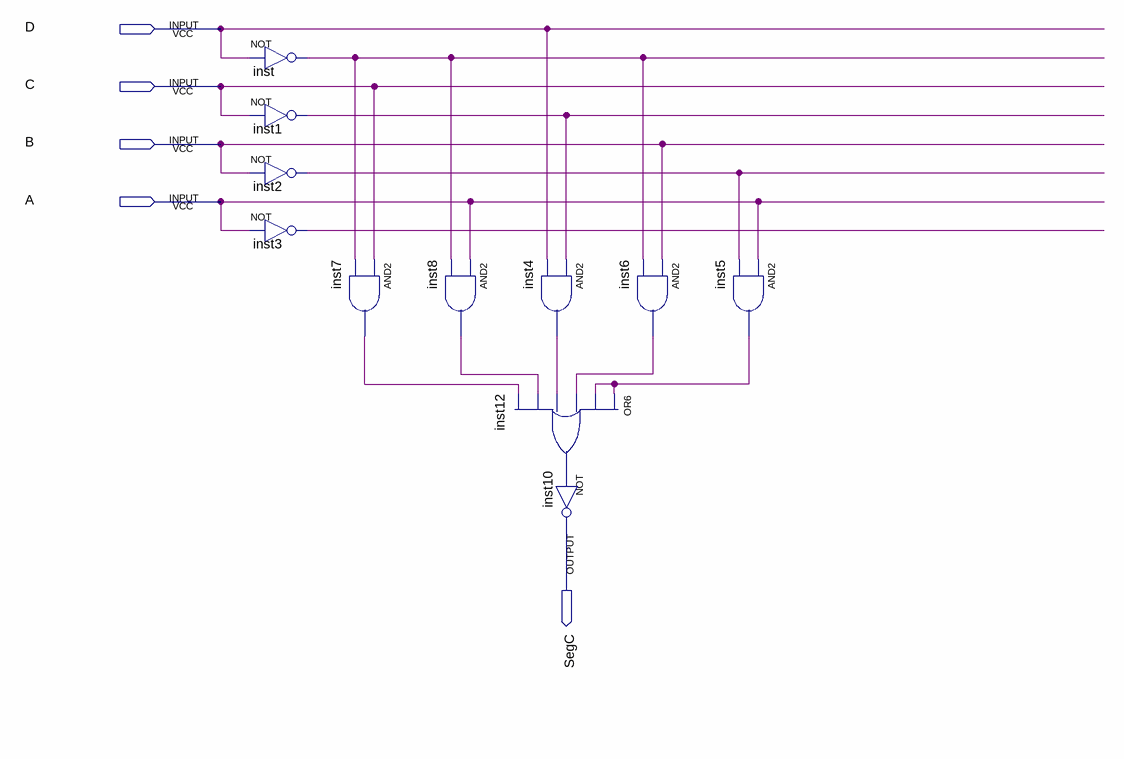
[diagram p0: schematic sheet]
// Quartus schematic SegC.bdf as structural Verilog: 11 symbols, 5 pins
module SegC (
  input  D,
  input  C,
  input  B,
  input  A,
  output SegC
);

  wire inst1_out, inst2_out, inst3_out, inst4_out, inst5_out, inst6_out, inst7_out, inst8_out, inst12_out,
       inst_out;

  not inst (inst_out, D);
  not inst1 (inst1_out, C);
  not inst2 (inst2_out, B);
  not inst3 (inst3_out, A);
  and inst7 (inst7_out, C, inst_out);
  and inst8 (inst8_out, A, inst_out);
  and inst4 (inst4_out, inst1_out, D);
  or inst12 (inst12_out, inst5_out, inst5_out, inst6_out, inst4_out, inst8_out, inst7_out);
  not inst10 (SegC, inst12_out);
  and inst6 (inst6_out, B, inst_out);
  and inst5 (inst5_out, A, inst2_out);
endmodule
